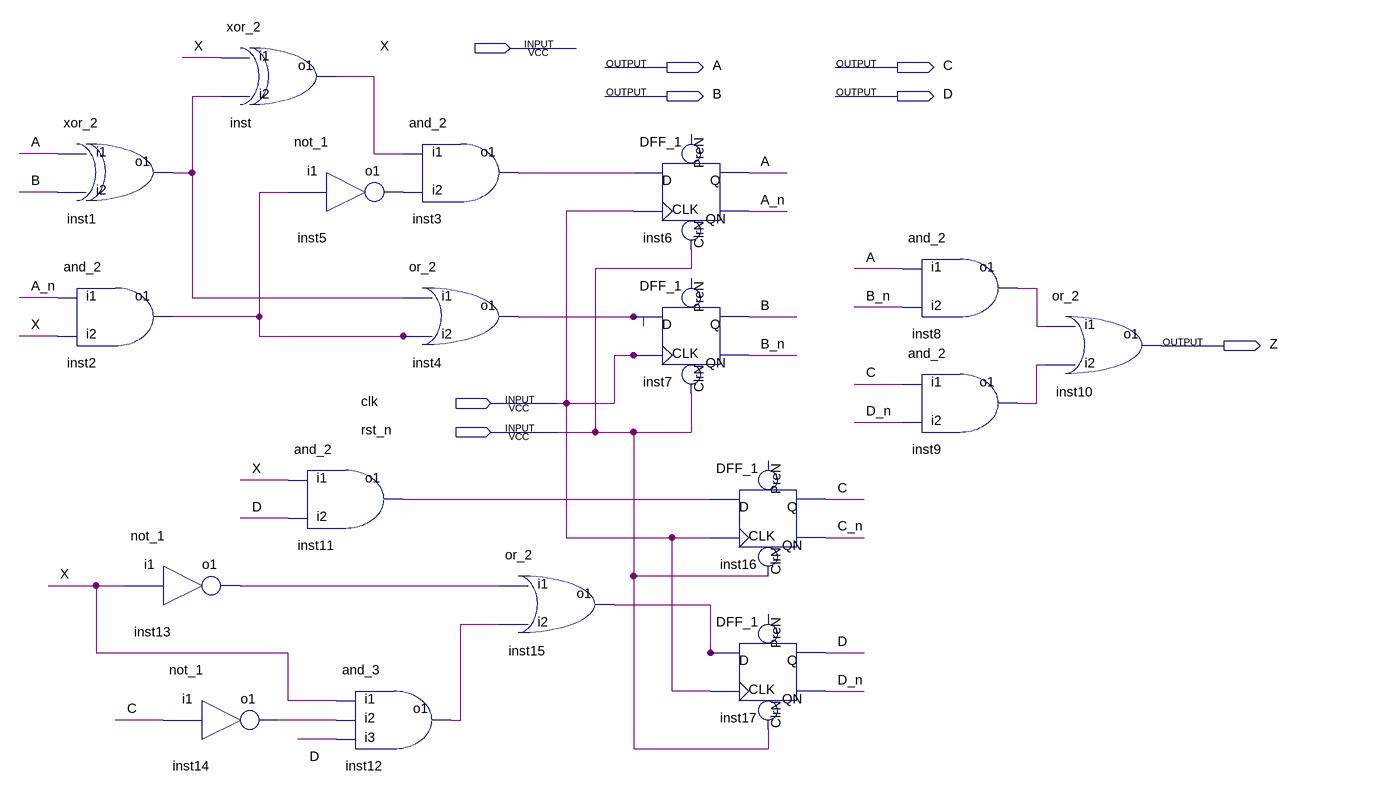
[diagram p0: schematic sheet]
// Quartus schematic SD.bdf as structural Verilog: 18 symbols, 8 pins
module SD (
  input  X,
  input  clk,
  input  rst_n,
  output A,
  output C,
  output B,
  output D,
  output Z
);

  wire A_n, B_n, C_n, D_n, inst1_o1, inst2_o1, inst3_o1, inst4_o1, inst5_o1, inst8_o1, inst9_o1, inst11_o1,
       inst12_o1, inst13_o1, inst14_o1, inst15_o1, inst_o1;

  xor_2 inst1 (.i1(A), .i2(B), .o1(inst1_o1));
  and_2 inst2 (.i1(A_n), .i2(X), .o1(inst2_o1));
  not_1 inst13 (.i1(X), .o1(inst13_o1));
  not_1 inst14 (.i1(C), .o1(inst14_o1));
  xor_2 inst (.i1(X), .i2(inst1_o1), .o1(inst_o1));
  not_1 inst5 (.i1(inst2_o1), .o1(inst5_o1));
  and_2 inst11 (.i1(X), .i2(D), .o1(inst11_o1));
  and_3 inst12 (.i1(X), .i2(inst14_o1), .i3(D), .o1(inst12_o1));
  and_2 inst3 (.i1(inst_o1), .i2(inst5_o1), .o1(inst3_o1));
  or_2 inst4 (.i1(inst1_o1), .i2(inst2_o1), .o1(inst4_o1));
  or_2 inst15 (.i1(inst13_o1), .i2(inst12_o1), .o1(inst15_o1));
  DFF_1 inst6 (.CLK(clk), .D(inst3_o1), .ClrN(rst_n), .QN(A_n), .Q(A));  // open: PreN
  DFF_1 inst7 (.CLK(clk), .D(inst4_o1), .ClrN(rst_n), .QN(B_n), .Q(B));  // open: PreN
  DFF_1 inst16 (.CLK(clk), .D(inst11_o1), .ClrN(rst_n), .QN(C_n), .Q(C));  // open: PreN
  DFF_1 inst17 (.CLK(clk), .D(inst15_o1), .ClrN(rst_n), .QN(D_n), .Q(D));  // open: PreN
  and_2 inst8 (.i1(A), .i2(B_n), .o1(inst8_o1));
  and_2 inst9 (.i1(C), .i2(D_n), .o1(inst9_o1));
  or_2 inst10 (.i1(inst8_o1), .i2(inst9_o1), .o1(Z));
endmodule
